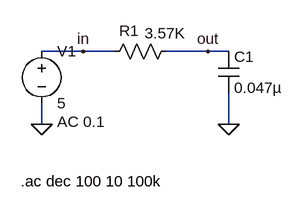
[diagram p0: schematic sqdecoder1.asc]
sqdecoder1.asc, the LTspice schematic file:
Version 4
SHEET 1 880 680
WIRE -64 128 -128 128
WIRE -16 128 -64 128
WIRE 128 128 64 128
WIRE 160 128 128 128
WIRE -128 240 -128 208
WIRE 160 240 160 192
FLAG 160 240 0
FLAG -64 128 in
FLAG 128 128 out
FLAG -128 240 0
SYMBOL res 80 112 R90
WINDOW 0 0 73 VBottom 2
WINDOW 3 -28 18 VTop 2
SYMATTR InstName R1
SYMATTR Value 3.57K
SYMATTR SpiceLine tol=1 pwr=0.1
SYMBOL cap 144 128 R0
SYMATTR InstName C1
SYMATTR Value 0.047µ
SYMATTR SpiceLine V=4 Irms=760m Rser=0.0732706 Lser=0 mfg="KEMET" pn="C0402C473K7PAC" type="X5R"
SYMBOL voltage -128 112 R0
WINDOW 123 24 124 Left 2
WINDOW 39 0 0 Left 0
SYMATTR Value2 AC 0.1
SYMATTR InstName V1
SYMATTR Value 5
TEXT -160 328 Left 2 !.ac dec 100 10 100k

The netlist it stands for:
* sqdecoder1.asc
R1 out in 3.57K tol=1 pwr=0.1
C1 out 0 0.047µ V=4 Irms=760m Rser=0.0732706 Lser=0 mfg="KEMET" pn="C0402C473K7PAC" type="X5R"
V1 in 0 5 AC 0.1
.ac dec 100 10 100k
.backanno
.end